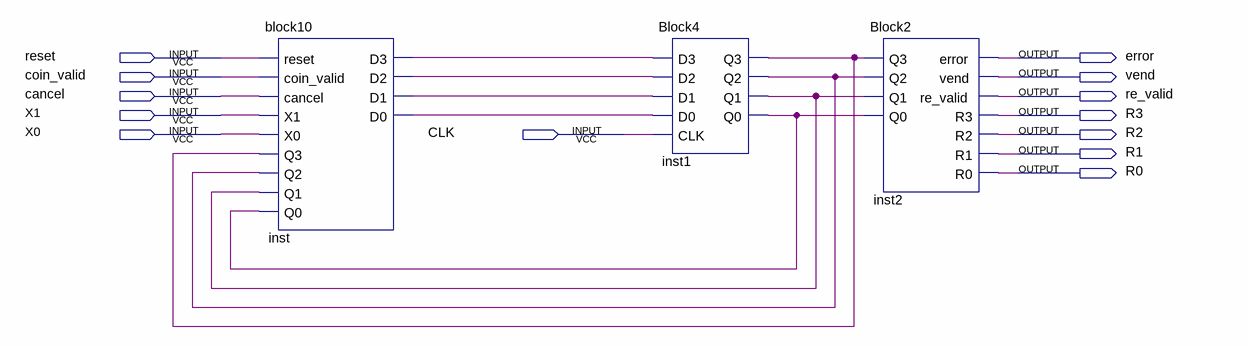
[diagram p0: schematic sheet]
// Quartus schematic block_cuoi.bdf as structural Verilog: 3 symbols, 13 pins
module block_cuoi (
  input  reset,
  input  coin_valid,
  input  cancel,
  input  X1,
  input  X0,
  input  CLK,
  output error,
  output vend,
  output re_valid,
  output R3,
  output R2,
  output R1,
  output R0
);

  wire inst1_q0, inst1_q1, inst1_q2, inst1_q3, inst_d0, inst_d1, inst_d2, inst_d3;

  block10 inst (
    .reset(reset), .coin_valid(coin_valid), .cancel(cancel), .X1(X1), .X0(X0), .Q3(inst1_q3), .Q2(inst1_q2),
    .Q1(inst1_q1), .Q0(inst1_q0), .D3(inst_d3), .D2(inst_d2), .D1(inst_d1), .D0(inst_d0));
  Block4 inst1 (
    .D3(inst_d3), .D2(inst_d2), .D1(inst_d1), .D0(inst_d0), .CLK(CLK), .Q3(inst1_q3), .Q2(inst1_q2),
    .Q1(inst1_q1), .Q0(inst1_q0));
  Block2 inst2 (
    .Q3(inst1_q3), .Q2(inst1_q2), .Q1(inst1_q1), .Q0(inst1_q0), .error(error), .vend(vend),
    .re_valid(re_valid), .R3(R3), .R2(R2), .R1(R1), .R0(R0));
endmodule
